# EAGLE design 10x10 (EAGLE 5.10)

## Sheet 1 of 4
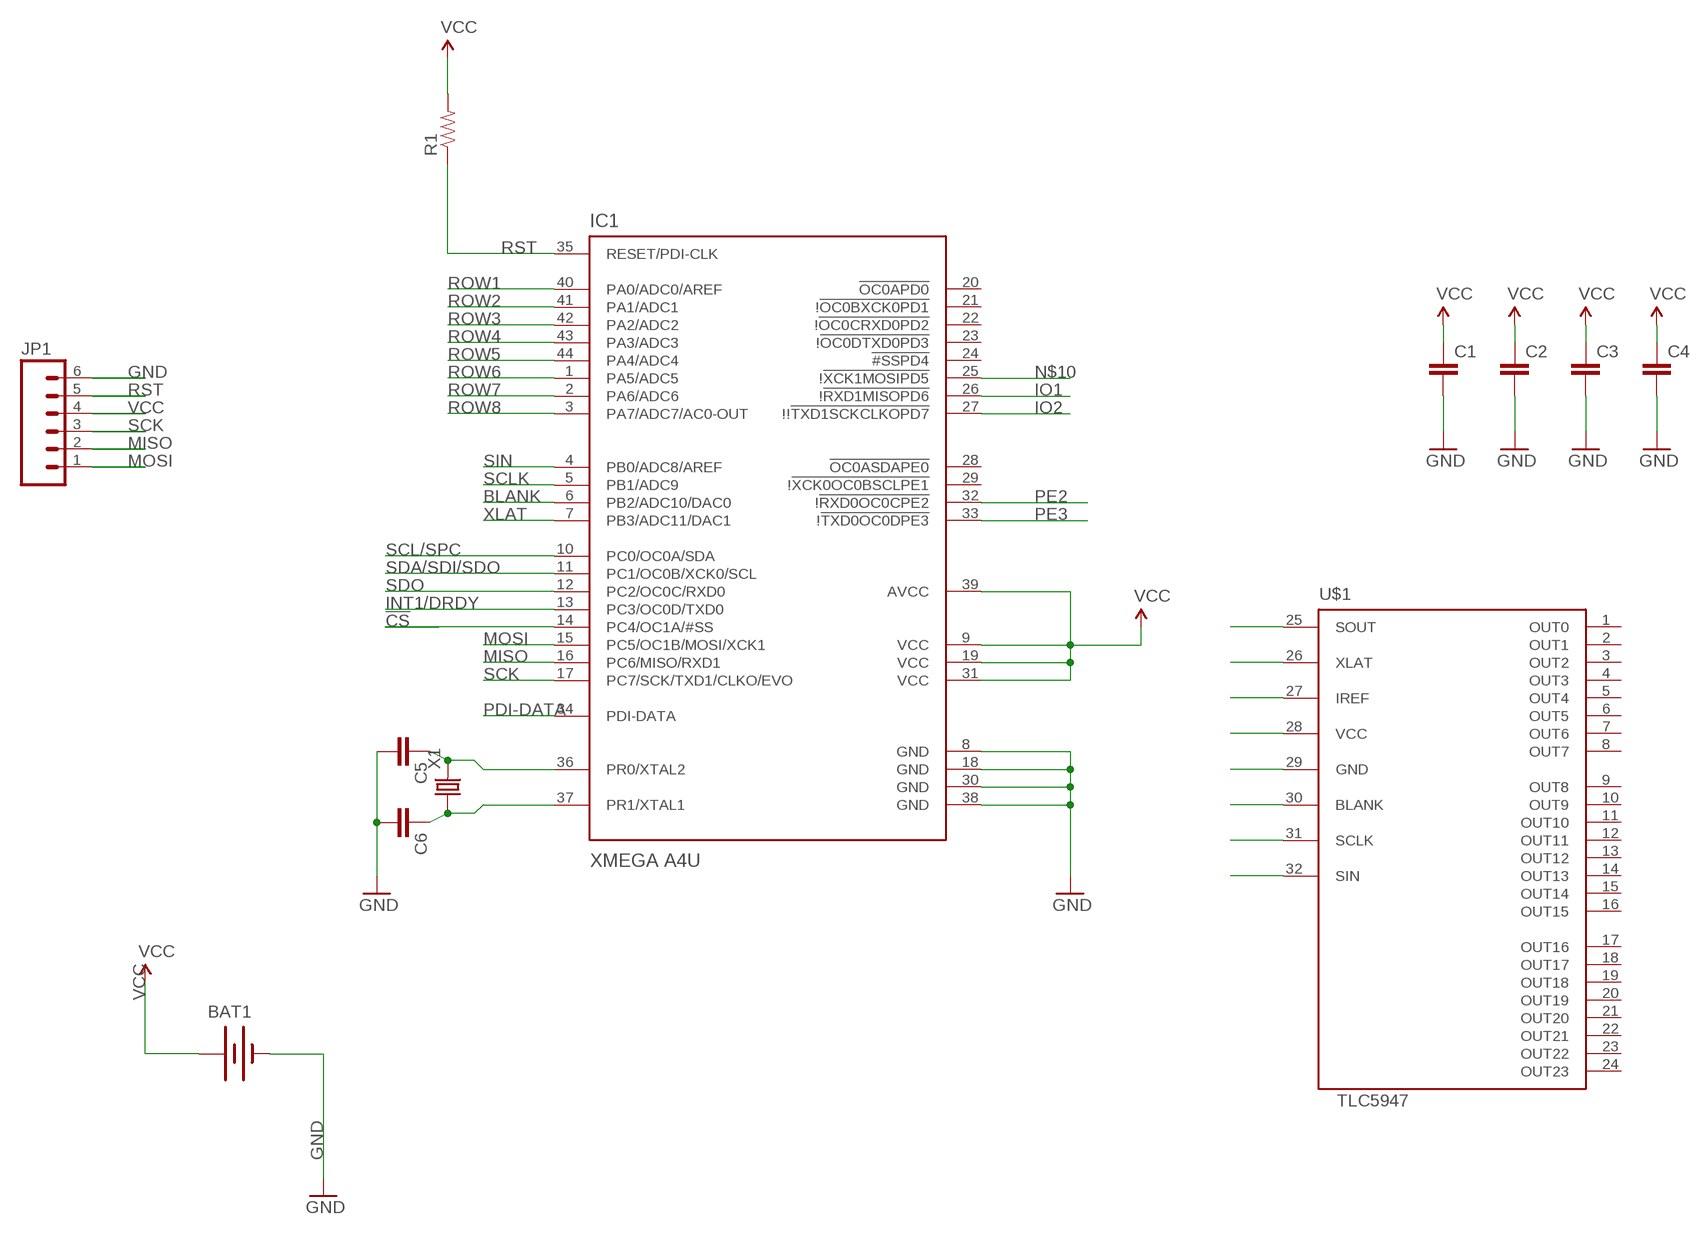
[diagram p0: schematic, sheet 1]

### Parts
BAT1  BATTERY245MM  [BATTCON_245MM]
C1  CAP0805  [0805]
C2  CAP0805  [0805]
C3  CAP0805  [0805]
C4  CAP0805  [0805]
C5  CAP0805  [0805]
C6  CAP0805  [0805]
IC1  XMEGA A4U  AT-XMEGA-XXA4-AU  [QFP80P1200X1200X120-44N]
JP1  M061X06-SMD_EDGE_FEMALE  [1X06-SMD_EDGE]
R1  RESISTOR0603-RES  [0603-RES]
U$1  TLC5947  [QFN32]
X1  CRYSTAL-5032  [5032]

### Nets
!CS: IC1.14(PC4/OC1A/#SS) ; also sheet 4
BLANK: IC1.6(PB2/ADC10/DAC0) U$1.30(BLANK)
GND: BAT1.2(-) C1.2 C2.2 C3.2 C4.2 C5.2 C6.2 IC1.8(GND) IC1.18(GND) IC1.30(GND) IC1.38(GND) JP1.6 U$1.29(GND) ; also sheet 3,4
INT1/DRDY: IC1.13(PC3/OC0D/TXD0) ; also sheet 4
IO1: IC1.26(!!RXD1MISOPD6) ; also sheet 3
IO2: IC1.27(!!!TXD1SCKCLKOPD7) ; also sheet 3
IREF: U$1.27(IREF)
MISO: IC1.16(PC6/MISO/RXD1) JP1.2
MOSI: IC1.15(PC5/OC1B/MOSI/XCK1) JP1.1
N$7: C5.1 IC1.36(PR0/XTAL2) X1.2
N$8: C6.1 IC1.37(PR1/XTAL1) X1.1
N$10: IC1.25(!!XCK1MOSIPD5)
PDI-DATA: IC1.34(PDI-DATA)
PE2: IC1.32(!!RXD0OC0CPE2)
PE3: IC1.33(!!TXD0OC0DPE3)
ROW1: IC1.40(PA0/ADC0/AREF) ; also sheet 2
ROW2: IC1.41(PA1/ADC1) ; also sheet 2
ROW3: IC1.42(PA2/ADC2) ; also sheet 2
ROW4: IC1.43(PA3/ADC3) ; also sheet 2
ROW5: IC1.44(PA4/ADC4) ; also sheet 2
ROW6: IC1.1(PA5/ADC5) ; also sheet 2
ROW7: IC1.2(PA6/ADC6) ; also sheet 2
ROW8: IC1.3(PA7/ADC7/AC0-OUT) ; also sheet 2
RST: IC1.35(RESET/PDI-CLK) JP1.5 R1.1
SCK: IC1.17(PC7/SCK/TXD1/CLKO/EVO) JP1.3
SCL/SPC: IC1.10(PC0/OC0A/SDA) ; also sheet 4
SCLK: IC1.5(PB1/ADC9) U$1.31(SCLK)
SDA/SDI/SDO: IC1.11(PC1/OC0B/XCK0/SCL) ; also sheet 4
SDO: IC1.12(PC2/OC0C/RXD0) ; also sheet 4
SIN: IC1.4(PB0/ADC8/AREF) U$1.32(SIN)
SOUT: U$1.25(SOUT)
VCC: BAT1.1(+) C1.1 C2.1 C3.1 C4.1 IC1.9(VCC) IC1.19(VCC) IC1.31(VCC) IC1.39(AVCC) JP1.4 R1.2 U$1.28(VCC) ; also sheet 2,3,4
XLAT: IC1.7(PB3/ADC11/DAC1) U$1.26(XLAT)
Unconnected: IC1.20(!OC0APD0) IC1.21(!!OC0BXCK0PD1) IC1.22(!!OC0CRXD0PD2) IC1.23(!!OC0DTXD0PD3) IC1.24(!#SSPD4) IC1.28(!OC0ASDAPE0) IC1.29(!!XCK0OC0BSCLPE1) U$1.1(OUT0) U$1.2(OUT1) U$1.3(OUT2) U$1.4(OUT3) U$1.5(OUT4) U$1.6(OUT5) U$1.7(OUT6) U$1.8(OUT7) U$1.9(OUT8) U$1.10(OUT9) U$1.11(OUT10) U$1.12(OUT11) U$1.13(OUT12) U$1.14(OUT13) U$1.15(OUT14) U$1.16(OUT15) U$1.17(OUT16) U$1.18(OUT17) U$1.19(OUT18) U$1.20(OUT19) U$1.21(OUT20) U$1.22(OUT21) U$1.23(OUT22) U$1.24(OUT23)

## Sheet 2 of 4
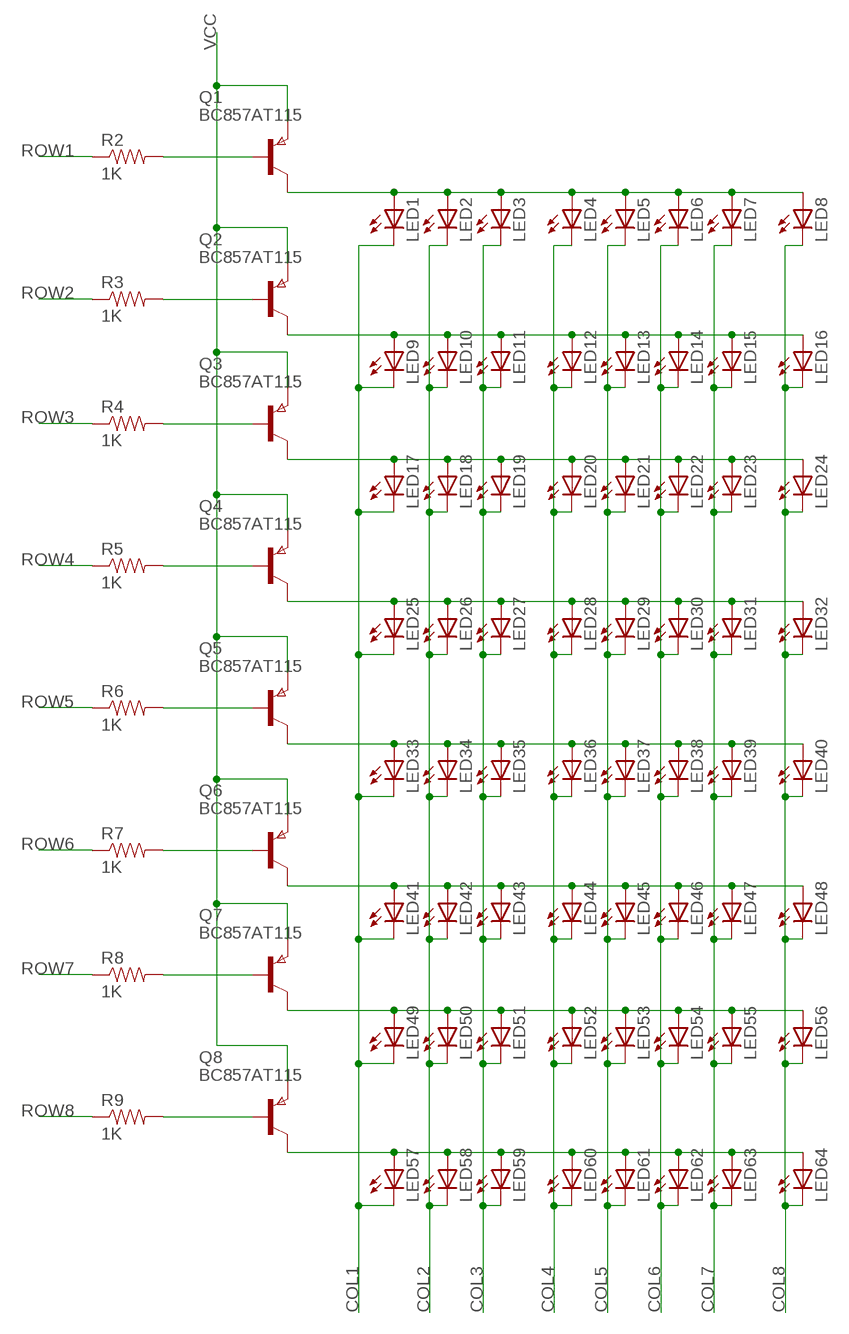
[diagram p1: schematic, sheet 2]

### Parts
LED1  LEDCHIPLED_1206  [CHIPLED_1206]
LED2  LEDCHIPLED_1206  [CHIPLED_1206]
LED3  LEDCHIPLED_1206  [CHIPLED_1206]
LED4  LEDCHIPLED_1206  [CHIPLED_1206]
LED5  LEDCHIPLED_1206  [CHIPLED_1206]
LED6  LEDCHIPLED_1206  [CHIPLED_1206]
LED7  LEDCHIPLED_1206  [CHIPLED_1206]
LED8  LEDCHIPLED_1206  [CHIPLED_1206]
LED9  LEDCHIPLED_1206  [CHIPLED_1206]
LED10  LEDCHIPLED_1206  [CHIPLED_1206]
LED11  LEDCHIPLED_1206  [CHIPLED_1206]
LED12  LEDCHIPLED_1206  [CHIPLED_1206]
LED13  LEDCHIPLED_1206  [CHIPLED_1206]
LED14  LEDCHIPLED_1206  [CHIPLED_1206]
LED15  LEDCHIPLED_1206  [CHIPLED_1206]
LED16  LEDCHIPLED_1206  [CHIPLED_1206]
LED17  LEDCHIPLED_1206  [CHIPLED_1206]
LED18  LEDCHIPLED_1206  [CHIPLED_1206]
LED19  LEDCHIPLED_1206  [CHIPLED_1206]
LED20  LEDCHIPLED_1206  [CHIPLED_1206]
LED21  LEDCHIPLED_1206  [CHIPLED_1206]
LED22  LEDCHIPLED_1206  [CHIPLED_1206]
LED23  LEDCHIPLED_1206  [CHIPLED_1206]
LED24  LEDCHIPLED_1206  [CHIPLED_1206]
LED25  LEDCHIPLED_1206  [CHIPLED_1206]
LED26  LEDCHIPLED_1206  [CHIPLED_1206]
LED27  LEDCHIPLED_1206  [CHIPLED_1206]
LED28  LEDCHIPLED_1206  [CHIPLED_1206]
LED29  LEDCHIPLED_1206  [CHIPLED_1206]
LED30  LEDCHIPLED_1206  [CHIPLED_1206]
LED31  LEDCHIPLED_1206  [CHIPLED_1206]
LED32  LEDCHIPLED_1206  [CHIPLED_1206]
LED33  LEDCHIPLED_1206  [CHIPLED_1206]
LED34  LEDCHIPLED_1206  [CHIPLED_1206]
LED35  LEDCHIPLED_1206  [CHIPLED_1206]
LED36  LEDCHIPLED_1206  [CHIPLED_1206]
LED37  LEDCHIPLED_1206  [CHIPLED_1206]
LED38  LEDCHIPLED_1206  [CHIPLED_1206]
LED39  LEDCHIPLED_1206  [CHIPLED_1206]
LED40  LEDCHIPLED_1206  [CHIPLED_1206]
LED41  LEDCHIPLED_1206  [CHIPLED_1206]
LED42  LEDCHIPLED_1206  [CHIPLED_1206]
LED43  LEDCHIPLED_1206  [CHIPLED_1206]
LED44  LEDCHIPLED_1206  [CHIPLED_1206]
LED45  LEDCHIPLED_1206  [CHIPLED_1206]
LED46  LEDCHIPLED_1206  [CHIPLED_1206]
LED47  LEDCHIPLED_1206  [CHIPLED_1206]
LED48  LEDCHIPLED_1206  [CHIPLED_1206]
LED49  LEDCHIPLED_1206  [CHIPLED_1206]
LED50  LEDCHIPLED_1206  [CHIPLED_1206]
LED51  LEDCHIPLED_1206  [CHIPLED_1206]
LED52  LEDCHIPLED_1206  [CHIPLED_1206]
LED53  LEDCHIPLED_1206  [CHIPLED_1206]
LED54  LEDCHIPLED_1206  [CHIPLED_1206]
LED55  LEDCHIPLED_1206  [CHIPLED_1206]
LED56  LEDCHIPLED_1206  [CHIPLED_1206]
LED57  LEDCHIPLED_1206  [CHIPLED_1206]
LED58  LEDCHIPLED_1206  [CHIPLED_1206]
LED59  LEDCHIPLED_1206  [CHIPLED_1206]
LED60  LEDCHIPLED_1206  [CHIPLED_1206]
LED61  LEDCHIPLED_1206  [CHIPLED_1206]
LED62  LEDCHIPLED_1206  [CHIPLED_1206]
LED63  LEDCHIPLED_1206  [CHIPLED_1206]
LED64  LEDCHIPLED_1206  [CHIPLED_1206]
Q1  BC857AT115  PNPSOT323SOT416  [SOT416]
Q2  BC857AT115  PNPSOT323SOT416  [SOT416]
Q3  BC857AT115  PNPSOT323SOT416  [SOT416]
Q4  BC857AT115  PNPSOT323SOT416  [SOT416]
Q5  BC857AT115  PNPSOT323SOT416  [SOT416]
Q6  BC857AT115  PNPSOT323SOT416  [SOT416]
Q7  BC857AT115  PNPSOT323SOT416  [SOT416]
Q8  BC857AT115  PNPSOT323SOT416  [SOT416]
R2  1K  SPARKFUN_RESISTOR  [SPARKFUN_0805]
R3  1K  SPARKFUN_RESISTOR  [SPARKFUN_0805]
R4  1K  SPARKFUN_RESISTOR  [SPARKFUN_0805]
R5  1K  SPARKFUN_RESISTOR  [SPARKFUN_0805]
R6  1K  SPARKFUN_RESISTOR  [SPARKFUN_0805]
R7  1K  SPARKFUN_RESISTOR0402-RES  [SPARKFUN_0402-RES]
R8  1K  SPARKFUN_RESISTOR  [SPARKFUN_0805]
R9  1K  SPARKFUN_RESISTOR  [SPARKFUN_0805]

### Nets
COL1: LED1.C LED9.C LED17.C LED25.C LED33.C LED41.C LED49.C LED57.C
COL2: LED2.C LED10.C LED18.C LED26.C LED34.C LED42.C LED50.C LED58.C
COL3: LED3.C LED11.C LED19.C LED27.C LED35.C LED43.C LED51.C LED59.C
COL4: LED4.C LED12.C LED20.C LED28.C LED36.C LED44.C LED52.C LED60.C
COL5: LED5.C LED13.C LED21.C LED29.C LED37.C LED45.C LED53.C LED61.C
COL6: LED6.C LED14.C LED22.C LED30.C LED38.C LED46.C LED54.C LED62.C
COL7: LED7.C LED15.C LED23.C LED31.C LED39.C LED47.C LED55.C LED63.C
COL8: LED8.C LED16.C LED24.C LED32.C LED40.C LED48.C LED56.C LED64.C
LINE1: LED1.A LED2.A LED3.A LED4.A LED5.A LED6.A LED7.A LED8.A Q1.1(C)
LINE2: LED9.A LED10.A LED11.A LED12.A LED13.A LED14.A LED15.A LED16.A Q2.1(C)
LINE3: LED17.A LED18.A LED19.A LED20.A LED21.A LED22.A LED23.A LED24.A Q3.1(C)
LINE4: LED25.A LED26.A LED27.A LED28.A LED29.A LED30.A LED31.A LED32.A Q4.1(C)
LINE5: LED33.A LED34.A LED35.A LED36.A LED37.A LED38.A LED39.A LED40.A Q5.1(C)
LINE6: LED41.A LED42.A LED43.A LED44.A LED45.A LED46.A LED47.A LED48.A Q6.1(C)
LINE7: LED49.A LED50.A LED51.A LED52.A LED53.A LED54.A LED55.A LED56.A Q7.1(C)
LINE8: LED57.A LED58.A LED59.A LED60.A LED61.A LED62.A LED63.A LED64.A Q8.1(C)
N$2: Q1.2(B) R2.2
N$6: Q2.2(B) R3.2
N$23: Q3.2(B) R4.2
N$34: Q4.2(B) R5.2
N$45: Q5.2(B) R6.2
N$56: Q6.2(B) R7.2
N$67: Q7.2(B) R8.2
N$78: Q8.2(B) R9.2
ROW1: R2.1 ; also sheet 1
ROW2: R3.1 ; also sheet 1
ROW3: R4.1 ; also sheet 1
ROW4: R5.1 ; also sheet 1
ROW5: R6.1 ; also sheet 1
ROW6: R7.1 ; also sheet 1
ROW7: R8.1 ; also sheet 1
ROW8: R9.1 ; also sheet 1
VCC: Q1.3(E) Q2.3(E) Q3.3(E) Q4.3(E) Q5.3(E) Q6.3(E) Q7.3(E) Q8.3(E) ; also sheet 1,3,4

## Sheet 3 of 4
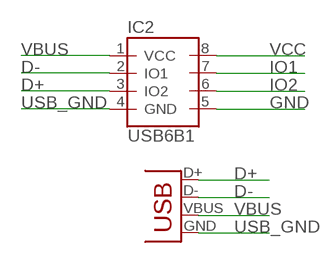
[diagram p2: schematic, sheet 3]

### Parts
IC2  USB6B1  [SO08]
USB1  USB-SMD-NS  [USB-MINIB-NOSTOP]

### Nets
D+: IC2.3(IO2) USB1.D+
D-: IC2.2(IO1) USB1.D-
GND: IC2.5(GND) ; also sheet 1,4
IO1: IC2.7(IO1) ; also sheet 1
IO2: IC2.6(IO2) ; also sheet 1
USB_GND: IC2.4(GND) USB1.GND
VBUS: IC2.1(VCC) USB1.VBUS
VCC: IC2.8(VCC) ; also sheet 1,2,4

## Sheet 4 of 4
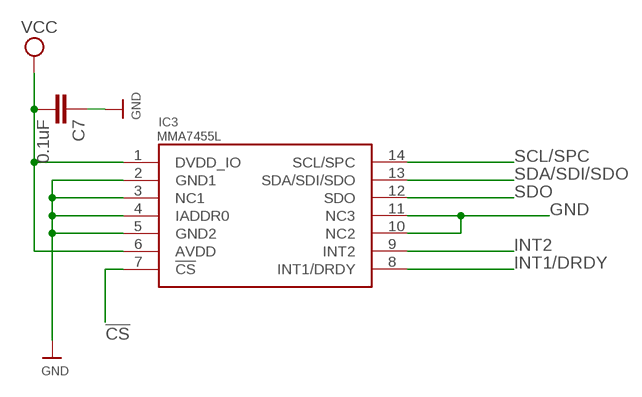
[diagram p3: schematic, sheet 4]

### Parts
C7  0.1uF  CAP0805  [0805]
IC3  MMA7455L  [LGA-14]

### Nets
!CS: IC3.7(!CS) ; also sheet 1
GND: C7.1 IC3.2(GND1) IC3.3(NC1) IC3.4(IADDR0) IC3.5(GND2) IC3.10(NC2) IC3.11(NC3) ; also sheet 1,3
INT1/DRDY: IC3.8(INT1/DRDY) ; also sheet 1
INT2: IC3.9(INT2)
SCL/SPC: IC3.14(SCL/SPC) ; also sheet 1
SDA/SDI/SDO: IC3.13(SDA/SDI/SDO) ; also sheet 1
SDO: IC3.12(SDO) ; also sheet 1
VCC: C7.2 IC3.1(DVDD_IO) IC3.6(AVDD) ; also sheet 1,2,3

## Library data of the parts
BAT1 = SparkFun:BATTERY: Battery Holders Various common sizes : AA, AAA, 20mm coin cell and 12mm coin cell.
C1-C7 = SparkFun:CAP: Capacitor Standard 0603 ceramic capacitor, and 0.1" leaded capacitor.
IC1 = xmega-a4:AT-XMEGA-XXA4-AU: ATxMega a4 Serie
IC2 = st-microelectronics:USB6B1: DATA LINES PROTECTION Source: http://www.st.com/stonline/products/literature/ds/5605.pdf; MPN: USB6B1; OC_FARNELL: 9804358; OC_NEWARK: 26M4750
IC3 = MMA7455Lbreakoutboard-v1a:MMA7455L
JP1 = SparkFun:M06: Header 6 Standard 6-pin 0.1" header. Use with straight break away headers (SKU : PRT-00116), right angle break away headers (PRT-00553), swiss pins (PRT-00743), machine pins (PRT-00117), and female headers (PRT-00115). Molex polarized connector foot print use with SKU : PRT-08094 with associated crimp pins and housings. NOTES ON THE VARIANTS LOCK and LOCK_LONGPADS... This footprint was designed to help hold the alignment of a through-hole component (i.e. 6-pin header) while soldering it into place. You may notice that each hole has been shifted either up or down by 0.005 of an inch from it's more standard position (which is a perfectly straight line). This slight alteration caused the pins (the squares in the middle) to touch the edges of the holes. Because they are alternating, it causes a "brace" to hold the component in place. 0.005 has proven to be the perfect amount of "off-center" position when using our standard breakaway headers. Although looks a little odd when you look at the bare footprint, once you have a header in there, the alteration is very hard to notice. Also, if you push a header all the way into place, it is covered up entirely on the bottom side. This idea of altering the position of holes to aid alignment will be further integrated into the Sparkfun Library for other footprints. It can help hold any component with 3 or more connection pins.
LED1-LED64 = led:LED: LED OSRAM: - CHIPLED LG R971, LG N971, LY N971, LG Q971, LY Q971, LO R971, LY R971 LH N974, LH R974 LS Q976, LO Q976, LY Q976 LO Q996 - Hyper CHIPLED LW Q18S LB Q993, LB Q99A, LB R99A - SideLED LS A670, LO A670, LY A670, LG A670, LP A670 LB A673, LV A673, LT A673, LW A673 LH A674 LY A675 LS A676, LA A676, LO A676, LY A676, LW A676 LS A679, LY A679, LG A679 - Hyper Micro SIDELED® LS Y876, LA Y876, LO Y876, LY Y876 LT Y87S - SmartLED LW L88C, LW L88S LB L89C, LB L89S, LG L890 LS L89K, LO L89K, LY L89K LS L896, LA L896, LO L896, LY L896 - TOPLED LS T670, LO T670, LY T670, LG T670, LP T670 LSG T670, LSP T670, LSY T670, LOP T670, LYG T670 LG T671, LOG T671, LSG T671 LB T673, LV T673, LT T673, LW T673 LH T674 LS T676, LA T676, LO T676, LY T676, LB T676, LH T676, LSB T676, LW T676 LB T67C, LV T67C, LT T67C, LS T67K, LO T67K, LY T67K, LW E67C LS E67B, LA E67B, LO E67B, LY E67B, LB E67C, LV E67C, LT E67C LW T67C LS T679, LY T679, LG T679 LS T770, LO T770, LY T770, LG T770, LP T770 LB T773, LV T773, LT T773, LW T773 LH T774 LS E675, LA E675, LY E675, LS T675 LS T776, LA T776, LO T776, LY T776, LB T776 LHGB T686 LT T68C, LB T68C - Hyper Mini TOPLED® LB M676 - Mini TOPLED Santana® LG M470 LS M47K, LO M47K, LY M47K Source: http://www.osram.convergy.de LUXEON: - LUMILED® LXK2-PW12-R00, LXK2-PW12-S00, LXK2-PW14-U00, LXK2-PW14-V00 LXK2-PM12-R00, LXK2-PM12-S00, LXK2-PM14-U00 LXK2-PE12-Q00, LXK2-PE12-R00, LXK2-PE12-S00, LXK2-PE14-T00, LXK2-PE14-U00 LXK2-PB12-K00, LXK2-PB12-L00, LXK2-PB12-M00, LXK2-PB14-N00, LXK2-PB14-P00, LXK2-PB14-Q00 LXK2-PR12-L00, LXK2-PR12-M00, LXK2-PR14-Q00, LXK2-PR14-R00 LXK2-PD12-Q00, LXK2-PD12-R00, LXK2-PD12-S00 LXK2-PH12-R00, LXK2-PH12-S00 LXK2-PL12-P00, LXK2-PL12-Q00, LXK2-PL12-R00 Source: www.luxeon.com KINGBRIGHT: KA-3528ASYC Source: www.kingbright.com
Q1-Q8 = zetex:PNPSOT323: PNP TRANSISTOR
R1 = SparkFun:RESISTOR: Resistor Basic schematic elements and footprints for 0603, 1206, and PTH 1/10th watt (small) resistors.
R2-R9 = Nullspace:SPARKFUN_RESISTOR: Resistor Basic schematic elements and footprints for 0603, 1206, and PTH 1/10th watt (small) resistors.
U$1 = slice:TLC5947
USB1 = SparkFun:USB: USB Connectors USB-B-PTH is fully proven SKU : PRT-00139 USB-miniB is fully proven SKU : PRT-00587 USB-A-PCB is untested. USB-A-H is throughly reviewed, but untested. Spark Fun Electronics SKU : PRT-00437 USB-B-SMT is throughly reviewed, but untested. Needs silkscreen touching up. USB-A-S has not been used/tested USB-MB-H has not been used/tested
X1 = NSL_MiniQuad:CRYSTAL*: CRYSTAL

## Net classes
0 default: width 0.254 mm
1 power: width 0.254 mm
2 leds: width 0.508 mm

## Board
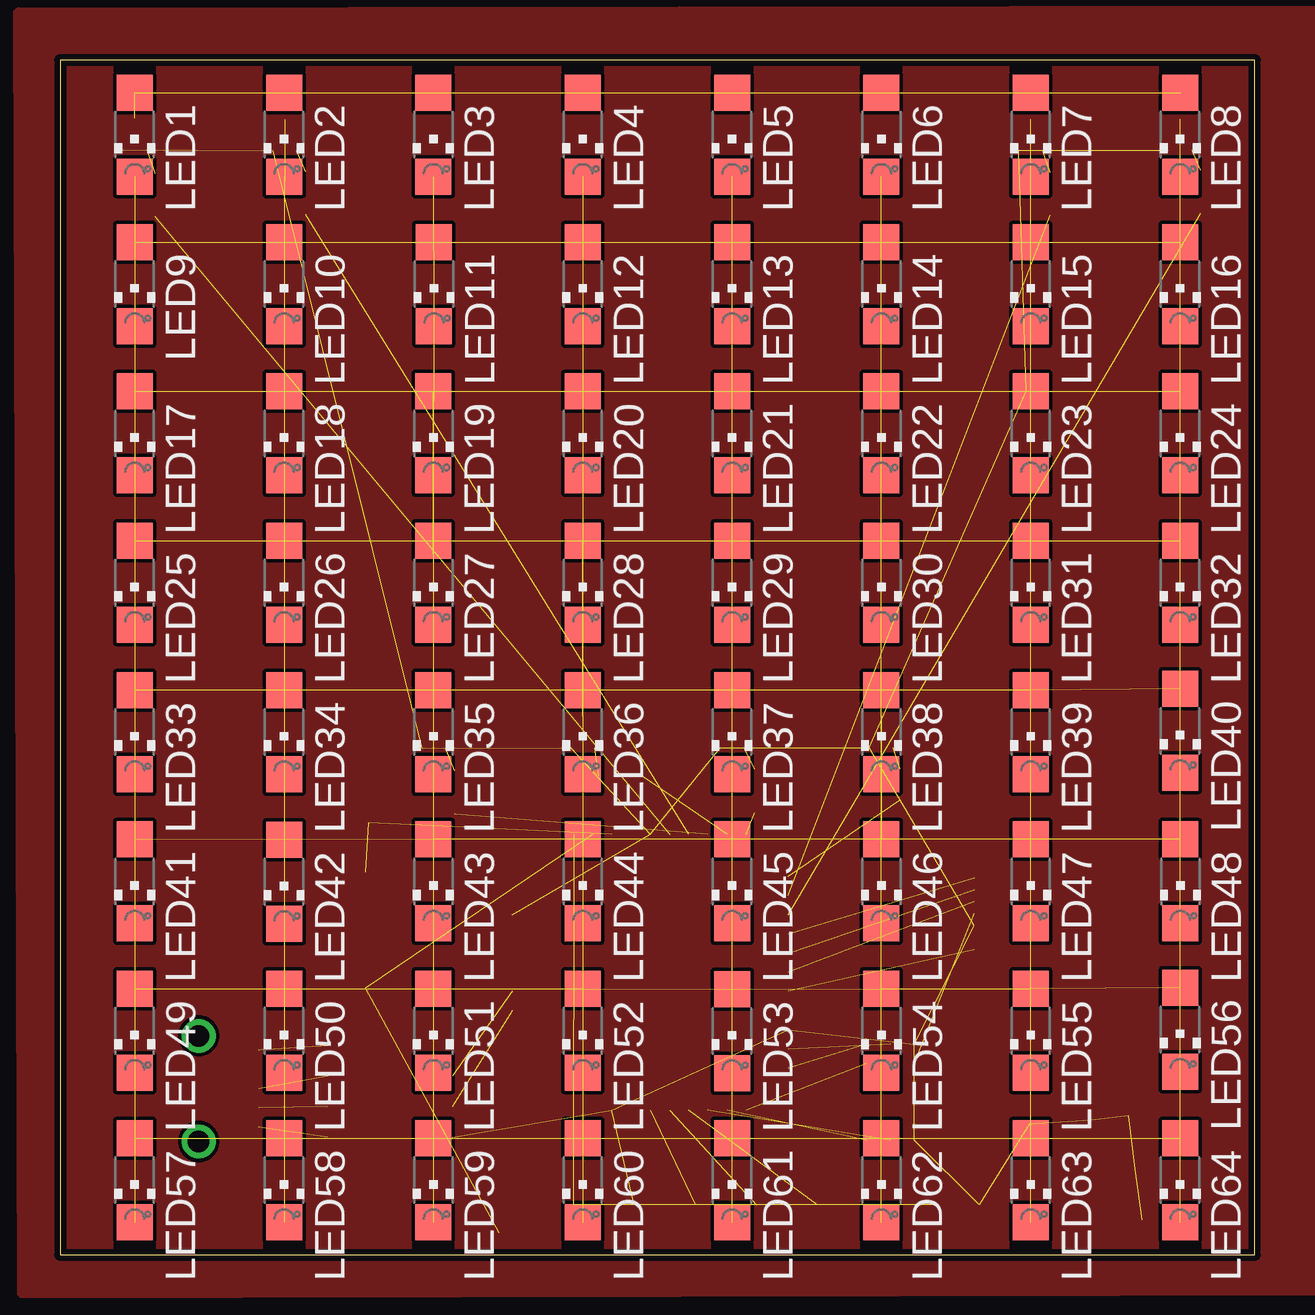
[diagram p4: board, top side]
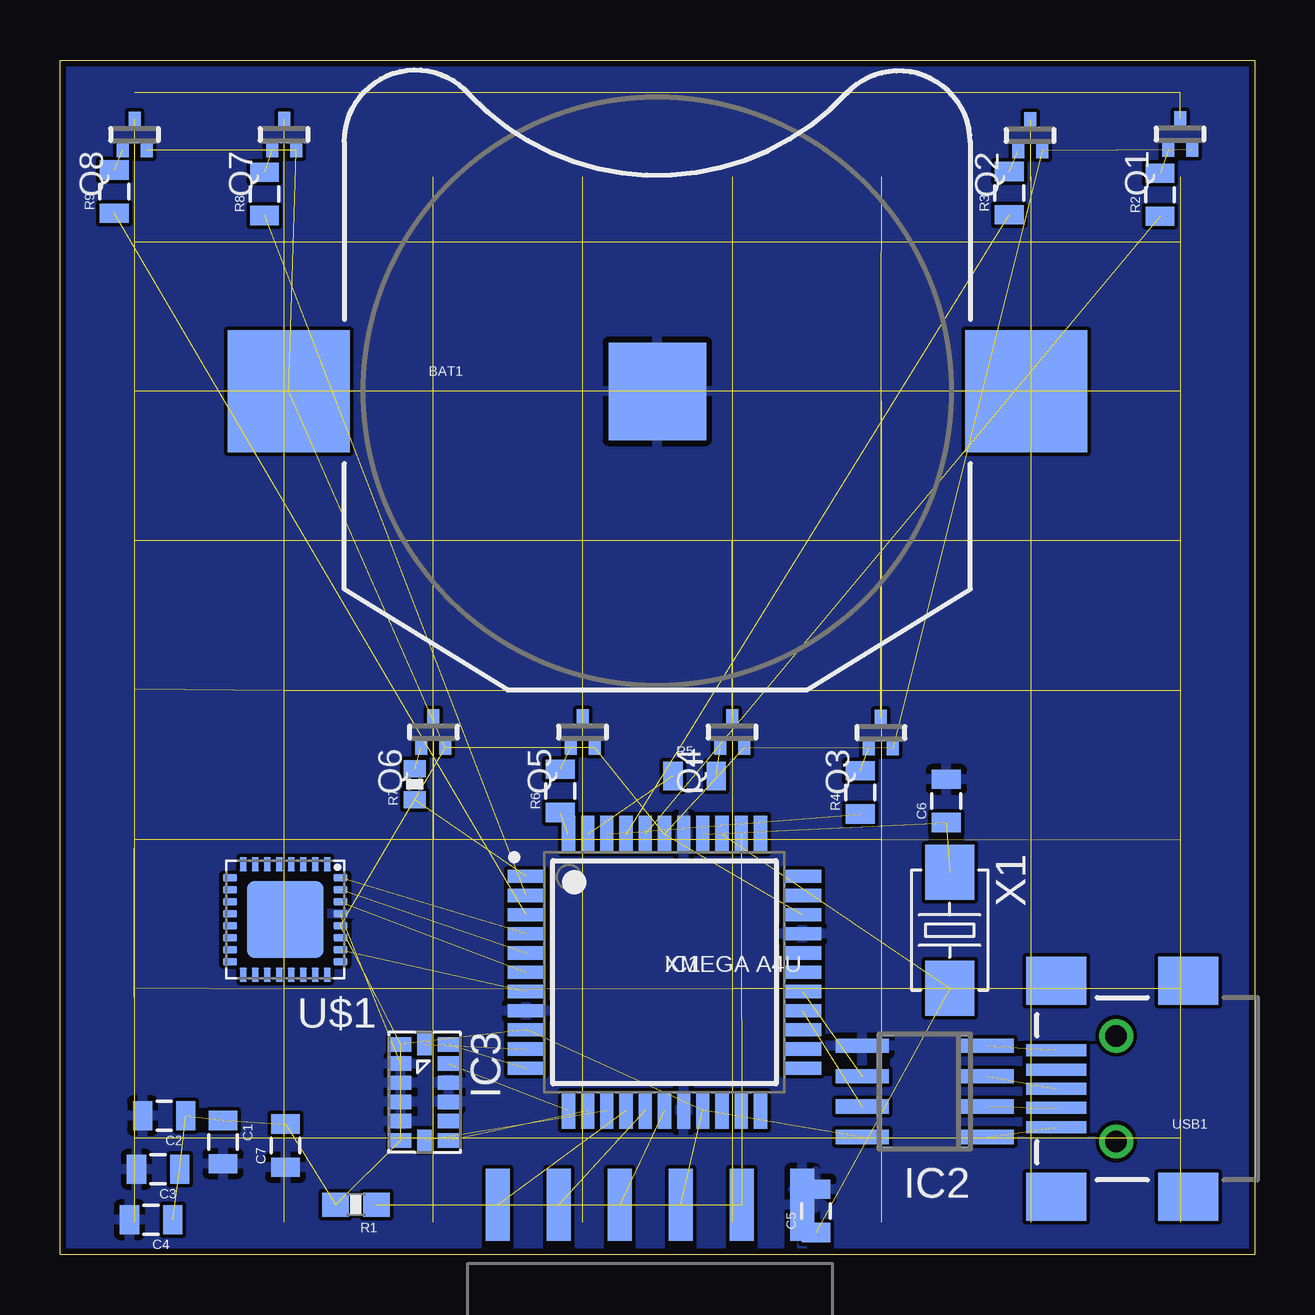
[diagram p5: board, bottom side, seen from below]

Size 49.78 x 49.78 mm. Coordinates in mm from the lower left corner, seen from the top.
Outline: 49.78,49.78 0,49.78 0,0 49.78,0 49.78,49.78
Copper layers (1*16): Top 0.035mm / dielectric 1.5mm / Bottom 0.035mm
Design rules "ITead_rule": minimum track width 6mil, minimum drill 12mil, track to track 6mil, track to pad 6mil, pad to pad 6mil, via to via 6mil, smd to smd 0mil, copper to edge 10mil, drill to drill 10mil, minimum pad ring 10mil, minimum via ring 6mil, stop-mask expansion 2mil, vias tented up to drill 100mil, thermal gap 10mil

### Footprints (pad centres in the part's own frame; a part is rotated, then mirrored left to right if it is on the bottom)
BATTCON_245MM = smd 5.08 x 5.08: 1 -15.367,0; 3 15.367,0 | smd 4.064 x 4.064: 2 0,0
0805 = smd 0.8 x 1.2: 1 -0.9,0; 2 0.9,0
QFP80P1200X1200X120-44N = smd 1.55 x 0.55: 1 -5.75,4; 2 -5.75,3.2; 3 -5.75,2.4; 4 -5.75,1.6; 5 -5.75,0.8; 6 -5.75,0; 7 -5.75,-0.8; 8 -5.75,-1.6; 9 -5.75,-2.4; 10 -5.75,-3.2; 11 -5.75,-4; 23 5.75,-4; 24 5.75,-3.2; 25 5.75,-2.4; 26 5.75,-1.6; 27 5.75,-0.8; 28 5.75,0; 29 5.75,0.8; 30 5.75,1.6; 31 5.75,2.4; 32 5.75,3.2; 33 5.75,4 | smd 0.55 x 1.55: 12 -4,-5.75; 13 -3.2,-5.75; 14 -2.4,-5.75; 15 -1.6,-5.75; 16 -0.8,-5.75; 17 0,-5.75; 18 0.8,-5.75; 19 1.6,-5.75; 20 2.4,-5.75; 21 3.2,-5.75; 22 4,-5.75; 34 4,5.75; 35 3.2,5.75; 36 2.4,5.75; 37 1.6,5.75; 38 0.8,5.75; 39 0,5.75; 40 -0.8,5.75; 41 -1.6,5.75; 42 -2.4,5.75; 43 -3.2,5.75; 44 -4,5.75
SO08 = smd 0.6 x 2.2: 1 -1.905,-2.6; 2 -0.635,-2.6; 3 0.635,-2.6; 4 1.905,-2.6; 5 1.905,2.6; 6 0.635,2.6; 7 -0.635,2.6; 8 -1.905,2.6
LGA-14 = smd 0.6 x 0.9: 1 -2,-1; 2 -1.2,-1; 3 -0.4,-1; 4 0.4,-1; 5 1.2,-1; 6 2,-1; 8 2,1; 9 1.2,1; 10 0.4,1; 11 -0.4,1; 12 -1.2,1; 13 -2,1 | smd 0.9 x 0.6: 7 2,0; 14 -2,0
1X06-SMD_EDGE = smd 1 x 3: 1 0,-0.08; 2 2.54,-0.08; 3 5.08,-0.08; 4 7.62,-0.08; 5 10.16,-0.08; 6 12.7,-0.08
CHIPLED_1206 = smd 1.5 x 1.5: A 0,-1.75; C 0,1.75
SOT416 = smd 0.6 x 0.5: 1 -0.65,0; 2 0.65,-0.5; 3 0.65,0.5
0603-RES = smd 1.1 x 1: 1 -0.85,0; 2 0.85,0
SPARKFUN_0805 = smd 0.8 x 1.2: 1 -0.9,0; 2 0.9,0
SPARKFUN_0402-RES = smd 0.7 x 0.9: 1 -0.65,0; 2 0.65,0
QFN32 = smd 0.3 x 0.6: 1 -1.75,-2.3; 2 -1.25,-2.3; 3 -0.75,-2.3; 4 -0.25,-2.3; 5 0.25,-2.3; 6 0.75,-2.3; 7 1.25,-2.3; 8 1.75,-2.3; 17 1.75,2.3; 18 1.25,2.3; 19 0.75,2.3; 20 0.25,2.3; 21 -0.25,2.3; 22 -0.75,2.3; 23 -1.25,2.3; 24 -1.75,2.3 | smd 0.6 x 0.3: 9 2.3,-1.75; 10 2.3,-1.25; 11 2.3,-0.75; 12 2.3,-0.25; 13 2.3,0.25; 14 2.3,0.75; 15 2.3,1.25; 16 2.3,1.75; 25 -2.3,1.75; 26 -2.3,1.25; 27 -2.3,0.75; 28 -2.3,0.25; 29 -2.3,-0.25; 30 -2.3,-0.75; 31 -2.3,-1.25; 32 -2.3,-1.75 | smd 3.2 x 3.2: EXP 0,0
USB-MINIB-NOSTOP = smd 2.5 x 0.5: D+ 2.5,0; D- 2.5,0.8; GND 2.5,-1.6; ID 2.5,-0.8; VBUS 2.5,1.6 | smd 2.5 x 2: G1 -3,-4.5; G2 -3,4.5; G3 2.5,4.5; G4 2.5,-4.5 | drill 0.9 pad 0.8 round: H1 0,2.2 | drill 0.9 pad 0.787 round: H2 0,-2.2
5032 = smd 2.286 x 2.032: 1 -2.413,0; 2 2.413,0

### Placement (x,y rotation side)
BAT1  24.89,35.98 0 bottom
C1  42.99,4.7 270 bottom
C2  45.44,5.79 180 bottom
C3  45.69,3.57 180 bottom
C4  45.99,1.46 180 bottom
C5  18.29,1.83 90 bottom
C6  12.85,18.91 90 bottom
C7  40.39,4.55 90 bottom
IC1  24.6,11.77 0 bottom
IC2  13.75,6.81 90 bottom
IC3  34.59,6.77 270 bottom
JP1  31.55,2.16 0 bottom
LED1  3.11,46.67 180 top
LED2  9.33,46.67 180 top
LED3  15.56,46.67 180 top
LED4  21.78,46.67 180 top
LED5  28,46.67 180 top
LED6  34.23,46.67 180 top
LED7  40.45,46.67 180 top
LED8  46.67,46.67 180 top
LED9  3.11,40.45 180 top
LED10  9.33,40.45 180 top
LED11  15.58,40.45 180 top
LED12  21.78,40.45 180 top
LED13  28,40.45 180 top
LED14  34.23,40.45 180 top
LED15  40.45,40.45 180 top
LED16  46.67,40.45 180 top
LED17  3.11,34.23 180 top
LED18  9.33,34.23 180 top
LED19  15.56,34.23 180 top
LED20  21.78,34.23 180 top
LED21  28,34.23 180 top
LED22  34.23,34.23 180 top
LED23  40.45,34.23 180 top
LED24  46.67,34.23 180 top
LED25  3.11,28 180 top
LED26  9.33,28 180 top
LED27  15.56,28 180 top
LED28  21.78,28 180 top
LED29  28,28 180 top
LED30  34.23,28 180 top
LED31  40.45,28 180 top
LED32  46.67,28 180 top
LED33  3.11,21.78 180 top
LED34  9.33,21.78 180 top
LED35  15.56,21.78 180 top
LED36  21.78,21.78 180 top
LED37  28,21.78 180 top
LED38  34.23,21.78 180 top
LED39  40.45,21.78 180 top
LED40  46.67,21.83 180 top
LED41  3.11,15.56 180 top
LED42  9.33,15.54 180 top
LED43  15.56,15.56 180 top
LED44  21.78,15.56 180 top
LED45  28,15.56 180 top
LED46  34.23,15.56 180 top
LED47  40.45,15.56 180 top
LED48  46.69,15.56 180 top
LED49  3.11,9.33 180 top
LED50  9.33,9.33 180 top
LED51  15.56,9.33 180 top
LED52  21.78,9.33 180 top
LED53  28,9.32 180 top
LED54  34.23,9.33 180 top
LED55  40.45,9.33 180 top
LED56  46.67,9.39 180 top
LED57  3.11,3.11 180 top
LED58  9.33,3.11 180 top
LED59  15.56,3.11 180 top
LED60  21.78,3.11 180 top
LED61  28,3.11 180 top
LED62  34.23,3.11 180 top
LED63  40.45,3.11 180 top
LED64  46.67,3.11 180 top
Q1  3.11,46.7 270 bottom
Q2  9.36,46.65 270 bottom
Q3  15.58,21.76 270 bottom
Q4  21.78,21.78 270 bottom
Q5  28,21.78 270 bottom
Q6  34.23,21.78 270 bottom
Q7  40.45,46.67 270 bottom
Q8  46.67,46.67 270 bottom
R1  37.45,2.1 180 bottom
R2  3.95,44.17 90 bottom
R3  10.24,44.23 90 bottom
R4  16.45,19.27 90 bottom
R5  23.34,19.95 0 bottom
R6  28.94,19.33 90 bottom
R7  35,19.61 90 bottom
R8  41.26,44.21 90 bottom
R9  47.52,44.3 90 bottom
U$1  40.4,13.97 180 bottom
USB1  5.78,6.92 180 bottom
X1  12.71,13.53 270 bottom

### Tracks (layer width: path | path; a pad name or v marks a point on that pad's centre or on a via)
!CS  (1 unrouted)
BLANK  (1 unrouted)
COL1  (7 unrouted)
COL2  (7 unrouted)
COL3  (7 unrouted)
COL4  (7 unrouted)
COL5  (7 unrouted)
COL6  (7 unrouted)
COL7  (7 unrouted)
COL8  (7 unrouted)
D+  (1 unrouted)
D-  (1 unrouted)
GND  (1 unrouted)
  pour Bottom: -1.14,50.94 51.19,50.94 51.19,-1.16 -1.16,-1.16 -1.16,50.94
  pour Top: 53.33,51.84 -1.75,51.75 -1.59,-1.6 53.29,-1.49
INT1/DRDY  (1 unrouted)
IO1  (1 unrouted)
IO2  (1 unrouted)
LINE1  (8 unrouted)
LINE2  (8 unrouted)
LINE3  (8 unrouted)
LINE4  (8 unrouted)
LINE5  (8 unrouted)
LINE6  (8 unrouted)
LINE7  (8 unrouted)
LINE8  (8 unrouted)
MISO  (1 unrouted)
MOSI  (1 unrouted)
N$2  (1 unrouted)
N$6  (1 unrouted)
N$7  (2 unrouted)
N$8  (2 unrouted)
N$23  (1 unrouted)
N$34  (1 unrouted)
N$45  (1 unrouted)
N$56  (1 unrouted)
N$67  (1 unrouted)
N$78  (1 unrouted)
ROW1  (1 unrouted)
ROW2  (1 unrouted)
ROW3  (1 unrouted)
ROW4  (1 unrouted)
ROW5  (1 unrouted)
ROW6  (1 unrouted)
ROW7  (1 unrouted)
ROW8  (1 unrouted)
RST  (2 unrouted)
SCK  (1 unrouted)
SCL/SPC  (1 unrouted)
SCLK  (1 unrouted)
SDA/SDI/SDO  (1 unrouted)
SDO  (1 unrouted)
SIN  (1 unrouted)
USB_GND  (1 unrouted)
VBUS  (1 unrouted)
VCC  (23 unrouted)
XLAT  (1 unrouted)